# EAGLE board 3d_force_DACV2.4.1fix (EAGLE 9.5.2)
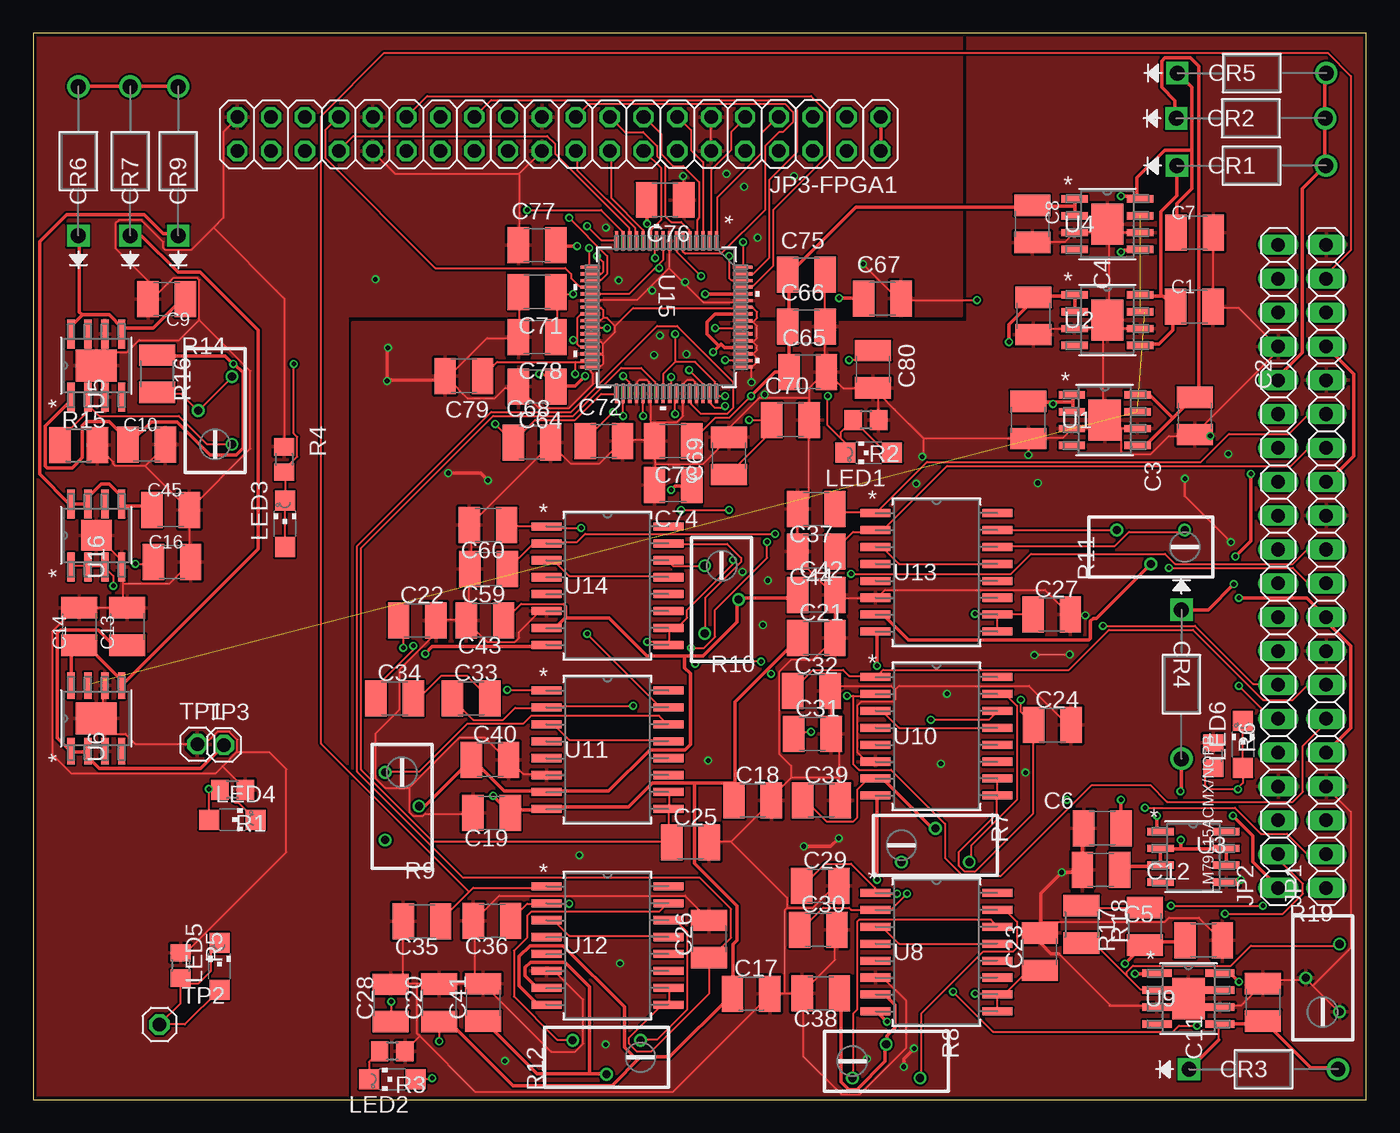
[diagram p5: board, top side]
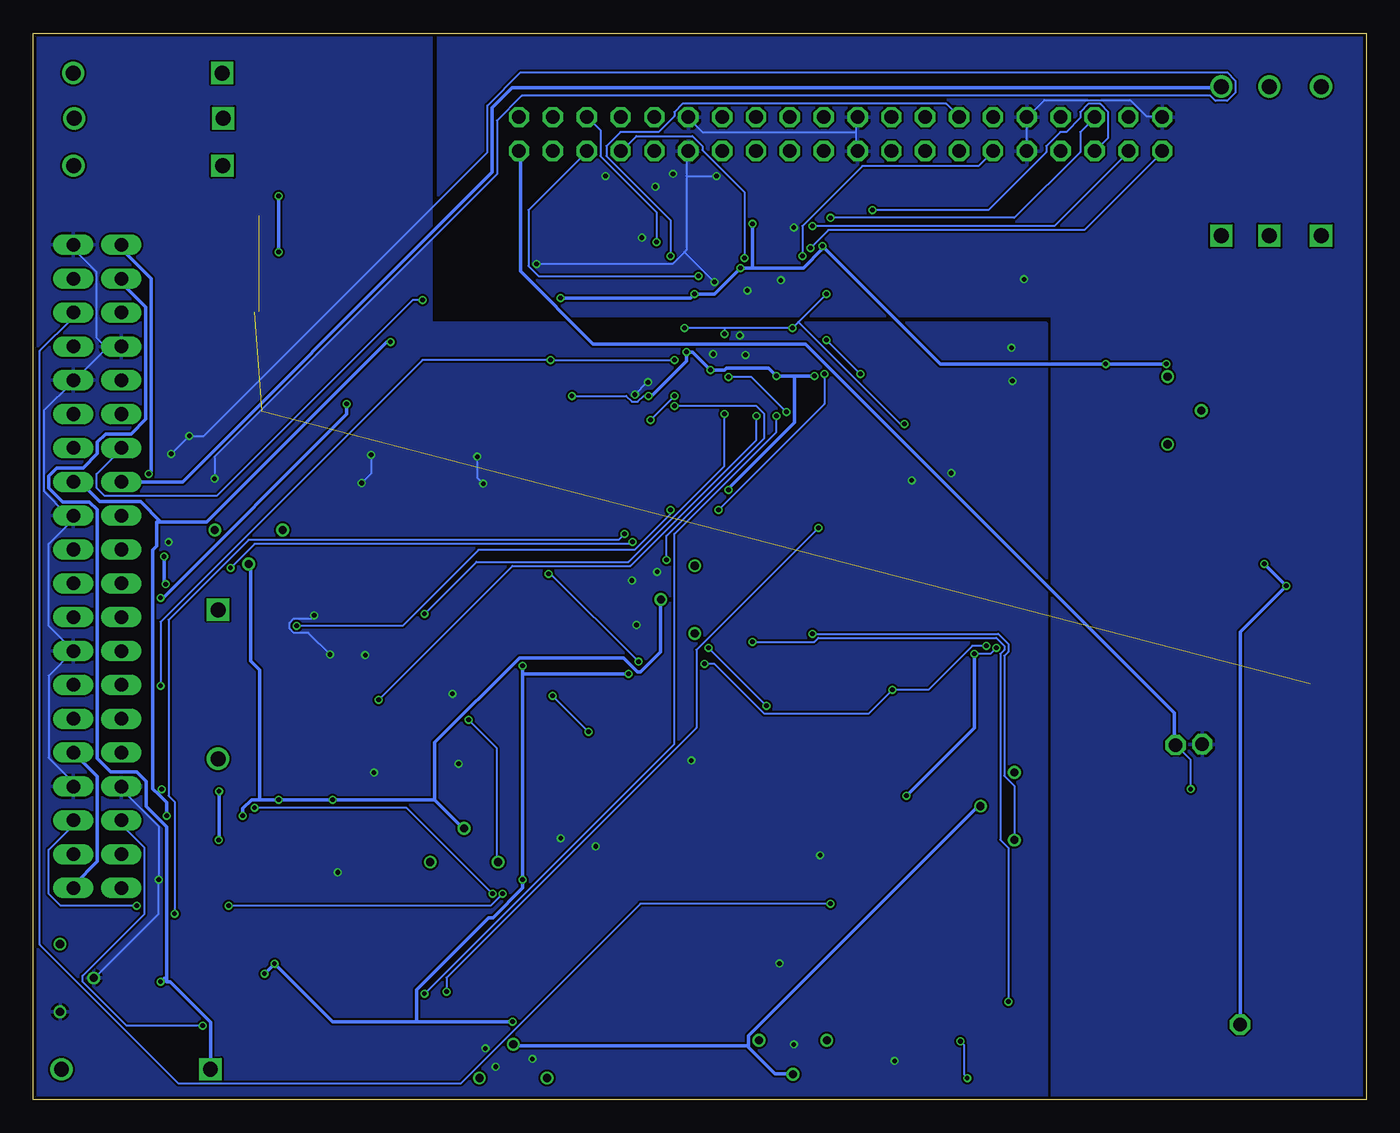
[diagram p6: board, bottom side, seen from below]

Size 100 x 80 mm. Coordinates in mm from the lower left corner, seen from the top.
Outline: 0,0 100,0 100,80 0,80 0,0
Copper layers (1*16): Top 0.018mm / dielectric 1.55mm / Bottom 0.018mm
Design rules "eC_2Layer_PClass6_BaseCopperO18_eCDefault": minimum track width 0.15mm, minimum drill 0.35mm, track to track 0.15mm, track to pad 0.15mm, pad to pad 0.15mm, via to via 0.15mm, smd to smd 0mil, copper to edge 0.25mm, drill to drill 0.35mm, minimum pad ring 0.175mm, minimum via ring 0.125mm, stop-mask expansion 0mil, vias tented up to drill 0.45mm, thermal gap 0.2mm

## Footprints (pad centres in the part's own frame; a part is rotated, then mirrored left to right if it is on the bottom)
C1210 = smd 1.6 x 2.7: 1 -1.4,0; 2 1.4,0
DO-41 = drill 1.118 pad 1.626 square: 1 -11.176,0 | drill 1.118 pad 1.626: 2 0,0
1X20 = drill 1.016 long: 1 -24.13,0; 2 -21.59,0; 3 -19.05,0; 4 -16.51,0; 5 -13.97,0; 6 -11.43,0; 7 -8.89,0; 8 -6.35,0; 9 -3.81,0; 10 -1.27,0; 11 1.27,0; 12 3.81,0; 13 6.35,0; 14 8.89,0; 15 11.43,0; 16 13.97,0; 17 16.51,0; 18 19.05,0; 19 21.59,0; 20 24.13,0
2X20 = drill 1.016 octagon: 1 -24.13,-1.27; 2 -24.13,1.27; 3 -21.59,-1.27; 4 -21.59,1.27; 5 -19.05,-1.27; 6 -19.05,1.27; 7 -16.51,-1.27; 8 -16.51,1.27; 9 -13.97,-1.27; 10 -13.97,1.27; 11 -11.43,-1.27; 12 -11.43,1.27; 13 -8.89,-1.27; 14 -8.89,1.27; 15 -6.35,-1.27; 16 -6.35,1.27; 17 -3.81,-1.27; 18 -3.81,1.27; 19 -1.27,-1.27; 20 -1.27,1.27; 21 1.27,-1.27; 22 1.27,1.27; 23 3.81,-1.27; 24 3.81,1.27; 25 6.35,-1.27; 26 6.35,1.27; 27 8.89,-1.27; 28 8.89,1.27; 29 11.43,-1.27; 30 11.43,1.27; 31 13.97,-1.27; 32 13.97,1.27; 33 16.51,-1.27; 34 16.51,1.27; 35 19.05,-1.27; 36 19.05,1.27; 37 21.59,-1.27; 38 21.59,1.27; 39 24.13,-1.27; 40 24.13,1.27
CHIPLED_1206 = smd 1.5 x 1.5: A 0,-1.75; C 0,1.75
R0805 = smd 1.3 x 1.5: 1 -0.95,0; 2 0.95,0
RTRIM3296Y = drill 0.61: 1 1.27,-2.54; 2 -1.27,0; 3 1.27,2.54
R1210 = smd 1.6 x 2.7: 1 -1.4,0; 2 1.4,0
1X01 = drill 1.016 octagon: 1 0,0
RD_8_2 = smd 1.981 x 0.559: 1 -2.464,1.905; 2 -2.464,0.635; 3 -2.464,-0.635; 4 -2.464,-1.905; 5 2.464,-1.905; 6 2.464,-0.635; 7 2.464,0.635; 8 2.464,1.905 | smd 2.413 x 3.099: EPAD 0,0
M08A = smd 1.981 x 0.559: 1 -2.464,1.905; 2 -2.464,0.635; 3 -2.464,-0.635; 4 -2.464,-1.905; 5 2.464,-1.905; 6 2.464,-0.635; 7 2.464,0.635; 8 2.464,1.905
RD_8_2' = smd 2.184 x 0.559: 1 -2.362,1.905; 2 -2.362,0.635; 3 -2.362,-0.635; 4 -2.362,-1.905; 5 2.362,-1.905; 6 2.362,-0.635; 7 2.362,0.635; 8 2.362,1.905 | smd 2.413 x 3.099: 9 0,0
SO-G16G6.9 = smd 2.261 x 0.61: 1 -9.149,8.89; 2 -9.149,7.62; 3 -9.149,6.35; 4 -9.149,5.08; 5 -9.149,3.81; 6 -9.149,2.54; 7 -9.149,1.27; 8 -9.149,0; 9 0,0; 10 0,1.27; 11 0,2.54; 12 0,3.81; 13 0,5.08; 14 0,6.35; 15 0,7.62; 16 0,8.89
21-0084C = smd 1.473 x 0.229: 1 -5.715,3.75; 2 -5.715,3.25; 3 -5.715,2.75; 4 -5.715,2.25; 5 -5.715,1.75; 6 -5.715,1.25; 7 -5.715,0.75; 8 -5.715,0.25; 9 -5.715,-0.25; 10 -5.715,-0.75; 11 -5.715,-1.25; 12 -5.715,-1.75; 13 -5.715,-2.25; 14 -5.715,-2.75; 15 -5.715,-3.25; 16 -5.715,-3.75; 33 5.715,-3.75; 34 5.715,-3.25; 35 5.715,-2.75; 36 5.715,-2.25; 37 5.715,-1.75; 38 5.715,-1.25; 39 5.715,-0.75; 40 5.715,-0.25; 41 5.715,0.25; 42 5.715,0.75; 43 5.715,1.25; 44 5.715,1.75; 45 5.715,2.25; 46 5.715,2.75; 47 5.715,3.25; 48 5.715,3.75 | smd 0.229 x 1.473: 17 -3.75,-5.715; 18 -3.25,-5.715; 19 -2.75,-5.715; 20 -2.25,-5.715; 21 -1.75,-5.715; 22 -1.25,-5.715; 23 -0.75,-5.715; 24 -0.25,-5.715; 25 0.25,-5.715; 26 0.75,-5.715; 27 1.25,-5.715; 28 1.75,-5.715; 29 2.25,-5.715; 30 2.75,-5.715; 31 3.25,-5.715; 32 3.75,-5.715; 49 3.75,5.715; 50 3.25,5.715; 51 2.75,5.715; 52 2.25,5.715; 53 1.75,5.715; 54 1.25,5.715; 55 0.75,5.715; 56 0.25,5.715; 57 -0.25,5.715; 58 -0.75,5.715; 59 -1.25,5.715; 60 -1.75,5.715; 61 -2.25,5.715; 62 -2.75,5.715; 63 -3.25,5.715; 64 -3.75,5.715
RD_8_1 = smd 2.184 x 0.559: 1 -2.362,1.905; 2 -2.362,0.635; 3 -2.362,-0.635; 4 -2.362,-1.905; 5 2.362,-1.905; 6 2.362,-0.635; 7 2.362,0.635; 8 2.362,1.905 | smd 2.286 x 2.286: 9 0,0

## Placement (x,y rotation side)
C1  1uF  [C1210]  87.11,59.5 0 top
C2  1uF  [C1210]  87.14,51.3 270 top
C3  1uF  [C1210]  74.64,51 270 top
C4  1uF  [C1210]  75.04,58.8 270 top
C5  0.1uF  [C1210]  80.2,20.36 180 top
C6  0.33uF  [C1210]  80.1,17.24 0 top
C7  1uF  [C1210]  87.13,65.04 0 top
C8  1uF  [C1210]  74.94,65.7 270 top
C9  1uF  [C1210]  10,60.06 180 top
C10  1uF  [C1210]  8.5,49.14 0 top
C11  1uF  [C1210]  92.26,7.3 90 top
C12  1uF  [C1210]  87.8,11.94 0 top
C13  1uF  [C1210]  7.06,35.5 90 top
C14  1uF  [C1210]  3.46,35.5 90 top
C16  2.2uF  [C1210]  10.4,40.34 0 top
C17  1uF  [C1210]  53.86,7.94 0 top
C18  1uF  [C1210]  53.97,22.44 0 top
C19  1uF  [C1210]  34.38,21.5 180 top
C20  1uF  [C1210]  30.46,7.26 90 top
C21  1uF  [C1210]  58.74,34.64 0 top
C22  1uF  [C1210]  28.8,35.94 0 top
C23  100pF  [C1210]  75.5,11.09 90 top
C24  100pF  [C1210]  76.45,28.09 0 top
C25  100pF  [C1210]  49.3,19.29 0 top
C26  100pF  [C1210]  50.71,12.05 90 top
C27  100pF  [C1210]  76.4,36.39 0 top
C28  100pF  [C1210]  26.81,7.25 90 top
C29  10pF  [C1210]  59.04,16.04 0 top
C30  10pF  [C1210]  58.89,12.74 0 top
C31  10pF  [C1210]  58.45,27.44 0 top
C32  10pF  [C1210]  58.38,30.64 0 top
C33  10pF  [C1210]  32.84,30.1 0 top
C34  10pF  [C1210]  27.1,30.1 0 top
C35  10pF  [C1210]  29.16,13.36 180 top
C36  10pF  [C1210]  34.41,13.41 180 top
C37  10pF  [C1210]  58.74,44.31 180 top
C38  1uF  [C1210]  59.08,7.96 180 top
C39  1uF  [C1210]  59.13,22.44 0 top
C40  1uF  [C1210]  34.26,25.5 0 top
C41  1uF  [C1210]  33.76,7.28 90 top
C42  1uF  [C1210]  58.74,37.84 0 top
C43  1uF  [C1210]  33.88,35.96 180 top
C44  10pF  [C1210]  58.74,41.11 180 top
C45  2.2uF  [C1210]  10.3,44.24 0 top
C59  10pF  [C1210]  34.16,39.81 180 top
C60  10pF  [C1210]  34.11,43.11 180 top
C64  0.1uF  [C1210]  37.8,53.5 180 top
C65  0.1uF  [C1210]  58.1,54.6 0 top
C66  0.1uF  [C1210]  58,58 0 top
C67  0.1uF  [C1210]  63.7,60.1 0 top
C68  33uF  [C1210]  37.4,49.3 0 top
C69  33uF  [C1210]  52.2,48.3 90 top
C70  33uF  [C1210]  56.8,51 0 top
C71  33uF  [C1210]  37.8,60.6 180 top
C72  0.1uF  [C1210]  42.8,49.4 0 top
C73  0.1uF  [C1210]  48,49.4 180 top
C74  0.1uF  [C1210]  48,46.1 180 top
C75  0.1uF  [C1210]  58,61.9 0 top
C76  0.1uF  [C1210]  47.4,67.5 180 top
C77  0.1uF  [C1210]  37.8,64.1 0 top
C78  33uF  [C1210]  37.8,57.2 180 top
C79  100pF  [C1210]  32.3,54.3 180 top
C80  100pF  [C1210]  63,54.8 270 top
CR1  1N4004G-T  [DO-41]  96.98,70.07 0 top
CR2  1N4004G-T  [DO-41]  96.93,73.62 0 top
CR3  1N4004G-T  [DO-41]  97.89,2.27 0 top
CR4  1N4004G-T  [DO-41]  86.14,25.57 270 top
CR5  1N4004G-T  [DO-41]  97.01,77.02 0 top
CR6  1N4004G-T  [DO-41]  3.38,76 90 top
CR7  1N4004G-T  [DO-41]  7.27,76 90 top
CR9  1N4004G-T  [DO-41]  10.87,76 90 top
JP1  JP1  [1X20]  97,40 90 top
JP2  JP2  [1X20]  93.4,40 90 top
JP3-FPGA1  FPGA-J3  [2X20]  39.43,72.44 180 top
LED1  [CHIPLED_1206]  62.67,48.53 90 top
LED2  [CHIPLED_1206]  26.93,1.52 90 top
LED3  [CHIPLED_1206]  18.88,43.19 0 top
LED4  [CHIPLED_1206]  14.93,21 270 top
LED5  [CHIPLED_1206]  13.97,9.99 0 top
LED6  [CHIPLED_1206]  90.76,26.65 0 top
R1  100  [R0805]  14.95,23.25 180 top
R2  100  [R0805]  62.47,50.99 180 top
R3  100  [R0805]  26.93,3.63 180 top
R4  100  [R0805]  18.82,48.03 270 top
R5  100  [R0805]  11.04,10.06 270 top
R6  100  [R0805]  88.53,25.81 270 top
R7  100k  [RTRIM3296Y]  67.68,19.08 270 top
R8  100k  [RTRIM3296Y]  63.99,2.88 270 top
R9  100k  [RTRIM3296Y]  27.66,22.01 180 top
R10  100k  [RTRIM3296Y]  51.65,37.51 180 top
R11  100k  [RTRIM3296Y]  83.84,41.46 90 top
R12  100k  [RTRIM3296Y]  43.01,3.17 90 top
R14  10k  [RTRIM3296Y]  13.63,51.7 0 top
R15  150K  [R1210]  3.4,49.09 0 top
R16  300k  [R1210]  9.29,54.46 270 top
R17  10k  [R1210]  78.64,13.14 270 top
R18  450k  [R1210]  83.41,12.99 90 top
R19  100k  [RTRIM3296Y]  96.73,9.12 0 top
TP1  FPGA_GND  [1X01]  12.3,26.66 0 top
TP2  FPGA_1V2  [1X01]  9.46,5.63 0 top
TP3  FPGA_3V3  [1X01]  14.3,26.6 0 top
U1  ADP7102ARDZ-5.0-R7  [RD_8_2]  80.38,50.98 0 top
U2  ADP7102ARDZ-5.0-R7  [RD_8_2]  80.58,58.48 0 top
U3  LM79L15ACMX/NOPB  [M08A]  87.03,18.21 0 top
U4  ADP7102ARDZ-5.0-R7  [RD_8_2]  80.58,65.68 0 top
U5  ADP7102ARDZ-R7  [RD_8_2']  4.72,55.07 90 top
U6  ADP7102ARDZ-3.3-R7  [RD_8_2]  4.72,28.59 90 top
U8  INA110KU  [SO-G16G6.9]  72.33,6.61 0 top
U9  ADP7102ARDZ-R7  [RD_8_2']  86.67,7.57 0 top
U10  INA110KU  [SO-G16G6.9]  72.33,22.81 0 top
U11  INA110KU  [SO-G16G6.9]  47.65,21.8 0 top
U12  INA110KU  [SO-G16G6.9]  47.65,7.11 0 top
U13  INA110KU  [SO-G16G6.9]  72.33,35.11 0 top
U14  INA110KU  [SO-G16G6.9]  47.65,34.11 0 top
U15  MAX11046ECB+  [21-0084C]  47.5,58.7 270 top
U16  ADP7118ARDZ  [RD_8_1]  4.72,42.33 90 top

## Tracks (layer width: path | path; a pad name or v marks a point on that pad's centre or on a via)
+15V
  Top 0.152: R3.2 25.18,2.83 LED2.C
+18V_IN  (via drill 0.35)
  Top 0.15: 92.1,5.7 92.25,5.85 C11.1 92.4,5.85 | 89.1,5.7 U9.5 88.95,5.55 88.95,4.5 | 97.8,2.4 CR3.2 | 89.1,9.45 U9.8 | 86.85,2.4 CR3.1
  Top 0.254: 92.1,5.7 89.1,5.7 | 97.8,2.4 95.85,2.4 92.4,5.85 | 89.1,9.45 89.85,9.45 v90.45,8.85 | 86.85,2.4 88.95,4.5
  Bottom 0.15: 86.7,2.4 CR3.1
  Bottom 0.254: 90,9.11 90.19,9.11 v90.45,8.85 | 86.7,2.4 86.7,5.81 89.73,8.84 90,8.84 90,9.11 | 90,9.11 90,20.45 91.53,21.98 91.53,23.88 92.25,24.6 94.2,24.6 95.2,25.6 95.2,44.26 95.79,44.85 97.8,44.85 98.85,45.9 98.85,46.8 98.25,47.4 96.26,47.4 95.2,48.46 95.2,49.32 94.57,49.95 92.65,49.95 91.56,51.04 91.56,59.46 93.3,61.2 93.3,61.5 JP2.19
-18V_IN  (via drill 0.35)
  Top 0.254: v91.35,46.95 91.35,41.91 v90.19,40.75 | v90.07,38.66 88.16,36.75 CR4.1
  Bottom 0.152: 90.19,38.86 90,38.67 90.01,38.66 v90.07,38.66
  Bottom 0.254: v91.35,46.95 91.14,47.16 91.14,61.59 93.3,63.75 93.3,64.05 JP2.20 | v90.19,40.75 90.19,38.86
-18V_IN1  (via drill 0.35)
  Top 0.152: U3.7 89.44,18.79 89.5,18.73 | 86.09,18.84 86.04,18.79 | U3.6 89.5,17.59 | U3.3 84.48,17.48
  Top 0.2: U3.2 84.62,18.79 85.13,18.79
  Top 0.254: 89.44,18.79 86.04,18.79 85.13,18.79 | v86.09,19.47 86.09,18.84 | 89.5,18.73 89.5,17.59 | C6.2 81.75,17.48 84.48,17.48 | U3.2 84.56,18.84 84.56,17.59 U3.3 | CR4.2 86.14,23.2 v86.07,23.13
  Bottom 0.152: 86.07,19.49 v86.09,19.47
  Bottom 0.254: v86.07,23.13 86.07,19.49
A5V_IN1
  Top 0.15: 96.9,73.65 CR2.2 96.9,73.5 | 96.9,76.95 CR5.2 | 96.9,70.05 CR1.2 96.9,70.2
  Top 0.254: 96.9,76.95 96.9,73.65 | 96.9,70.05 95.2,68.35 95.2,56.05 93.45,54.3 93.45,54 JP2.16 | 96.9,70.2 96.9,73.5
A5V_IN1_1
  Top 0.15: 83.1,56.7 U2.5 | 85.5,59.42 C1.1 85.63,59.5 | 84.75,60.3 84.6,60.3 | 83.1,60.3 U2.8 | 85.8,70.05 CR1.1
  Top 0.254: 83.1,56.7 84.45,56.7 85.5,57.75 85.5,59.42 | 83.1,60.3 84.6,60.3 84.6,66.63 85.8,67.83 85.8,70.05 | 85.63,59.5 84.75,60.3
A5V_IN1_2
  Top 0.15: 83.55,49.2 82.95,49.2 U1.5 | 87,52.65 C2.1 87.15,52.8 87.43,53.08 | 82.95,52.8 U1.8
  Top 0.254: 87,52.65 85.5,51.15 | 85.5,51.15 83.55,49.2 | 82.95,52.8 83.85,52.8 85.5,51.15 | 87.43,53.08 87.43,77.53 86.81,78.15 84.88,78.15 84.65,77.92 84.65,75.95 85.65,74.95 85.65,73.65 CR2.1
A5V_IN1_3  (via drill 0.35)
  Top 0.15: v81.6,63.6 81.75,63.75 | 82.95,63.75 U4.5 | 85.8,65.08 C7.1 | 82.95,67.65 82.8,67.8 U4.8 82.95,67.65
  Top 0.254: 81.75,63.75 82.95,63.75 | v81.6,67.8 82.8,67.8 82.8,69.15 84.9,71.25 86.93,71.25 | 85.8,65.08 85.8,67.2 86.93,68.33 86.93,71.25 | 86.93,71.25 86.93,75.97 85.95,76.95 CR5.1
  Bottom 0.254: v81.6,67.8 v81.6,63.6
A15V+  (via drill 0.35)
  Top 0.15: 84.3,9.45 U9.1 | 83.4,11.7 R18.1 83.55,11.7 83.7,11.85 | 63.3,6.6 U8.8 | 63.3,22.8 U10.8 | 63.3,35.1 U13.8 | 86.4,11.85 C12.1 | 52.35,7.8 C17.1 52.5,7.95 | 31.2,5.85 30.6,5.85 C20.1 | v27.75,33.9 27.75,35.55 27.45,35.85 C22.1 | 38.4,21.75 U11.8 38.57,21.94 | 35.85,21.6 C19.1 35.7,21.6 | 52.65,23.74 52.65,23.7 C18.1 52.65,22.5 | 57.3,34.5 C21.1
  Top 0.152: C20.1 v30.46,4.38 v30.45,4.37 | v29.93,1.61 29.84,1.52 LED2.A
  Top 0.254: v82.65,9.45 84.3,9.45 | 83.4,11.7 v81.9,10.2 | v64.05,5.85 63.3,6.6 | v63.3,16.5 63.3,22.8 | v63.3,32.55 63.3,35.1 | 83.7,11.85 86.4,11.85 | 45.56,3.19 47.74,3.19 52.35,7.8 | 45.56,3.19 45.07,3.19 44.34,3.92 44.34,6.96 39.75,11.55 37.28,11.55 36.46,10.73 36.46,8.54 37.8,7.2 38.4,7.2 U12.8 | 31.2,5.85 36,1.05 43.42,1.05 45.56,3.19 | v29.4,33.45 29.93,33.98 38.28,33.98 U14.8 | 38.4,21.75 36,21.75 35.85,21.6 | 52.65,23.7 52.65,22.5 | 57.3,34.5 55.05,32.25 | 55.05,32.25 52.65,29.85 52.65,23.74 49.62,23.74 | 38.57,21.94 44.67,21.94 46.47,23.74 49.62,23.74 | 35.7,21.6 v34.5,22.8 | 52.5,7.95 52.5,11.66 52.79,11.95 52.79,14.55 49.62,17.72 49.62,23.74 | 55.05,32.25 v55.35,31.95
  Bottom 0.15: v29.4,33.45 28.2,33.45 v27.75,33.9
  Bottom 0.152: v30.45,4.37 30.17,4.09 30.17,1.88 29.93,1.64 v29.93,1.61
  Bottom 0.254: v82.65,9.45 v81.9,10.2 77.55,5.85 71.25,5.85 | 71.25,5.85 v64.05,5.85 | 63.3,31.95 v63.3,16.5 63.3,15.87 65.52,13.65 65.84,13.65 71.25,8.24 71.25,5.85 | 63.3,31.95 v63.3,32.55 | v29.4,33.45 29.4,27.9 v34.5,22.8 | v55.35,31.95 63.3,31.95
A15V-  (via drill 0.35)
  Top 0.15: 63.3,36.3 U13.7 | 63.3,24 U10.7 63.15,24 62.55,24 61.8,23.25 61.8,21.15 61.5,20.85 59.55,20.85 58.05,22.35 57.75,22.35 C39.1 | 63.97,7.8 63.3,7.8 U8.7 | 64.05,4.2 R8.2 63.9,4.05 | 60.6,7.95 C38.1 | 42.9,1.95 R12.2 | 33.9,5.85 C41.1 | 37.8,8.4 38.4,8.4 U12.7 | 28.95,22.05 R9.2 | C40.1 33,25.5 | 39.94,37.01 39.75,37.2 36.6,37.2 35.4,36 C43.1 | 38.55,35.4 U14.7 | 57.15,37.65 57.3,37.8 C42.1 | 52.95,37.65 R10.2 52.8,37.5 | 38.62,23.14 U11.7
  Top 0.2: 84.3,20.38 U3.1
  Top 0.254: 63.3,36.3 63.87,36.3 65.67,34.5 79.21,34.5 79.31,34.6 79.31,35.89 79.52,36.1 79.75,36.1 R11.2 | 63.3,24 63.83,24 67.43,20.4 67.65,20.4 R7.2 | v84.3,21.3 84.3,20.56 84.3,20.38 | 64.05,4.2 64.05,4.8 64.65,5.4 64.65,7.12 63.97,7.8 | 60.6,7.95 60.6,1.35 61.2,0.75 61.78,0.75 63.9,2.87 63.9,4.05 | 41.74,1.95 37.8,1.95 33.9,5.85 | 41.74,1.95 42.9,1.95 | 37.8,8.4 36.91,9.29 36.91,9.91 37.29,10.29 39.9,10.29 41.74,8.45 41.74,1.95 | 28.95,22.05 29.4,22.05 C40.1 | 33,25.5 35.33,23.17 38.17,23.17 U11.7 | 38.55,35.4 39.15,35.4 39.9,36.15 39.94,36.15 | 39.94,37.01 39.94,36.15 | 57.15,37.65 52.95,37.65 | 39.94,36.15 43.21,36.15 46.06,33.3 48.89,33.3 | 48.89,33.3 50.25,33.3 52.8,35.85 52.8,37.5 | 38.62,23.14 43.17,23.14 46.28,26.25 48.9,26.25 49.29,26.64 49.29,31.97 48.86,32.4 48.86,33.27 48.89,33.3 | C5.1 v81.6,22.5
  Bottom 0.15: 43.05,1.95 R12.2 | 28.99,22.13 R9.2 | 52.95,37.5 R10.2
  Bottom 0.254: v84.3,21.3 84.3,21.83 83.63,22.5 83.03,22.5 | 69.9,22.5 v77.55,22.5 v81.6,22.5 83.03,22.5 | 69.9,22.5 67.8,20.4 R7.2 | 83.03,22.5 83.03,32.25 83.7,32.92 83.7,40.05 R11.2 | 46.46,4.05 46.35,4.05 46.35,4.77 28.99,22.13 | 46.46,4.05 63.9,4.05 R8.2 | 46.46,4.05 44.36,1.95 43.05,1.95 | 69.9,22.5 69.9,26.78 63.53,33.15 55.72,33.15 54.67,32.1 54.45,32.1 52.95,33.6 52.95,37.5
ADC_AV5.3  (via drill 0.35)
  Top 0.15: 40.8,57 40.8,58.65 41.1,58.95 U15.24 | 40.8,57 40.8,56.7 40.95,56.55 41.7,56.55 U15.29 | v44.25,54.3 44.7,53.85 44.7,53.1 U15.35 | 39.3,53.55 C64.1 38.25,54.45 v37.95,54.45 | U15.46 50.25,53.7 v49.2,54.75 | v40.5,57 40.8,57 | 49.35,46.05 C74.1 | C73.1 51.15,51.15 52.2,51.15 v53.85,52.8 | 56.7,57.9 C66.1 56.7,58.05 | 56.7,61.8 C75.1 56.7,61.95 | 78.15,66.45 U4.2 | 78.15,67.5 U4.1 | 75,67.05 C8.1
  Top 0.152: LED1.C 60.92,49.27 60.56,49.63 | 60.56,49.63 60.56,50.03 61.45,50.92 R2.2 63.98,48.53 LED1.A | 60.56,49.63 59.59,50.6 59.59,52.82 v59.6,52.81 v59.6,52.8 | 74.9,66.95 75,67.05
  Top 0.254: U15.52 53.2,56.43 51.87,56.43 51.6,56.7 51.45,56.55 | 51.45,56.55 50.55,57.45 50.55,58.35 51.15,58.95 U15.57 | v41.4,54.3 40.65,53.55 39.3,53.55 | 49.35,46.05 48.15,46.05 v47.85,45.75 | v51,56.1 51.45,56.55 | v53.85,52.8 55.65,54.6 C65.1 56.7,57.9 | 56.7,58.05 56.7,61.8 | 56.7,61.95 61.7,66.95 74.9,66.95 | 78.15,67.5 78.15,67.05 | 78.15,67.05 78.15,66.45 | 75,67.05 78.15,67.05
  Bottom 0.15: v37.95,54.45 v40.5,57
  Bottom 0.152: v59.6,52.8 55.52,52.8 55.09,52.36 54.65,52.36 54.22,52.8 v53.85,52.8
  Bottom 0.254: v41.4,54.3 42.9,54.3 | 42.9,54.3 v44.25,54.3 44.85,54.9 48,54.9 48.15,54.75 v49.2,54.75 50.55,56.1 v51,56.1 51,55.42 53.62,52.8 v53.85,52.8 | v47.85,45.75 47.85,45.86 42.9,50.81 42.9,54.3
ADC_DV3.7  (via drill 0.35)
  Top 0.15: 2.7,52.35 2.7,52.65 U5.1 | 9.3,55.8 R16.1 | 7.2,49.2 C10.1 | U15.21 44.7,60.45 46.8,62.55 | 46.8,62.55 47.25,63 U15.9 | 46.8,62.55 v46.95,62.4 | 39.3,64.05 C77.2 | 46.05,67.5 C76.2 | 62.25,60.15 C67.1
  Top 0.152: LED3.A LED3.C 18.88,47.02 R4.2 18.82,47.26 19.8,48.24 19.8,49.72 19.54,49.98 v19.54,55.2
  Top 0.254: 2.7,52.35 0.9,50.55 0.9,47.53 1.03,47.4 2.9,47.4 3.68,48.18 3.68,50.58 3.97,50.87 5.7,50.87 7.29,49.28 | 9.3,55.8 14.4,55.8 v15,55.2 15.08,55.2 15.75,54.53 15.75,48.9 15.22,48.37 13.28,48.37 10.8,50.85 8.85,50.85 7.29,49.28 | 7.2,49.2 7.29,49.28 | v50.4,60.45 U15.60 | v40.8,64.05 39.3,64.05 | v46.05,65.7 46.05,67.5 | v60.45,60.15 62.25,60.15
  Bottom 0.254: 46.05,62.4 v46.95,62.4 48.9,60.45 v50.4,60.45 50.7,60.15 v60.45,60.15 | 46.05,62.4 42.23,62.4 40.8,63.83 v40.8,64.05 31.95,55.2 v19.54,55.2 v15,55.2 | 46.05,62.4 v46.05,65.7
AGND  (via drill 0.35)
  Top 0.15: C12.2 89.1,12 87.45,13.65 85.2,13.65 84.9,13.35 75.6,13.35 75.6,12.6 C23.2 75.6,12.45 | 96,8.55 95.55,9 R19.2 95.4,9 92.7,9 92.4,8.7 C11.2 90.6,7.05 89.1,7.05 U9.6 88.95,7.05 87.15,7.05 86.7,7.5 U9.9 86.55,7.5 86.1,7.05 84.45,7.05 U9.3 84.3,7.05 | 96,8.55 97.95,6.6 R19.1 | C7.2 88.51,65.02 C1.2 88.76,59.4 90.45,59.4 93.3,56.55 JP2.17 93.3,56.4 93.3,56.1 87.15,49.95 C2.2 87,49.8 85.2,49.8 83.85,48.45 81.75,48.45 81.6,48.6 81.6,50.4 | U1.EPAD 79.8,50.4 78,50.4 U1.3 77.85,50.25 77.25,49.65 74.7,49.65 C3.2 74.55,49.65 66.75,49.65 64.61,51.78 | 81.6,50.4 80.85,50.4 80.4,50.85 U1.EPAD | 81.6,50.4 82.8,50.4 U1.6 | 80.25,58.05 80.55,58.35 U2.EPAD | 80.25,58.05 80.1,57.9 78.15,57.9 U2.3 78.05,57.79 75.9,57.79 C4.2 | U2.6 82.95,57.9 81.15,57.9 80.7,58.35 U2.EPAD | U4.EPAD 80.55,65.55 80.1,65.1 78.15,65.1 U4.3 78,64.95 77.4,64.35 75,64.35 C8.2 | 81.15,65.1 82.95,65.1 U4.6 | 81.15,65.1 80.7,65.55 U4.EPAD | 81.15,65.1 80.7,64.65 80.7,58.5 U2.EPAD | 81.15,65.1 U4.EPAD | 80.25,58.05 80.25,51 U1.EPAD | 80.25,58.05 U2.EPAD | 96,8.55 98.85,11.4 98.85,21.6 97.05,23.4 JP1.4 | 28.8,8.7 30.45,8.7 C20.2 30.6,8.7 32.55,8.7 33.15,9.3 | 28.8,8.7 27.75,8.7 | 27.75,8.7 26.85,8.7 C28.2 27.75,8.7 | 27.75,8.7 C35.2 | U12.6 38.55,9.6 39.15,9.6 41.25,7.5 41.25,4.2 40.65,3.6 38.85,3.6 33.9,8.55 C41.2 | 33.15,9.3 33.15,13.35 C36.2 33.15,13.5 34.95,15.3 48.9,15.3 50.7,13.5 C26.2 | 33.15,9.3 33.75,8.7 C41.2 | 33.15,9.3 C41.2 | U8.6 63.75,9.15 65.5,7.4 65.5,3.87 62.01,0.38 60.62,0.38 57.75,3.25 57.75,7.95 C38.2 | 56.4,7.95 57.6,7.95 C38.2 | 56.4,7.95 55.35,7.95 C17.2 55.2,7.8 47.96,0.56 33.19,0.56 29,4.75 28.8,4.95 28.8,8.7
  Top 0.15: C30.2 60.15,12.6 60.15,10.5 57.75,8.1 C38.2 | 56.55,14.4 58.5,14.4 60,15.9 60.3,15.9 C29.2 | 56.55,14.4 56.4,14.25 56.4,7.95 | 52.35,19.35 50.7,19.35 C25.2 | 52.35,19.35 55.35,22.35 C18.2 55.5,22.5 55.5,22.8 56.85,24.15 | U10.6 62.55,25.35 61.8,26.1 61.8,29.55 62.1,29.85 64.5,29.85 64.65,30 64.65,30.75 | 64.65,30.75 64.35,31.05 60.15,31.05 59.85,30.75 C32.2 59.85,30.6 C31.2 59.85,27.3 60.45,26.7 60.45,24.15 | 60.45,24.15 60.45,22.5 C39.2 | 64.65,30.75 64.95,31.05 74.7,31.05 77.55,28.2 77.85,28.2 C24.2 | 60.45,24.15 56.85,24.15 | 56.55,14.4 56.55,15.15 52.35,19.35 | U11.6 38.4,24.45 36.75,24.45 35.7,25.5 C40.2 35.55,25.5 33.9,27.15 31.95,27.15 28.2,23.4 | 28.2,23.4 28.2,21.6 28.5,21.3 29.25,21.3 29.4,21.45 32.85,21.45 C19.2 | U14.6 38.4,36.6 37.95,36.6 36.45,35.1 36.45,34.65 36.15,34.35 34.05,34.35 32.55,35.85 C43.2 | C43.2 32.4,36 30.3,36 C22.2 30.15,35.85 30.15,34.95 27.45,32.25 27.45,29.25 25.65,27.45 25.65,24.15 26.4,23.4 28.2,23.4 | C43.2 32.55,36 32.7,36.15 32.7,39.75 C59.2 32.85,39.9 32.85,43.05 C60.2 32.85,43.2 38.85,49.2 | 53.88,55.05 54,55.05 54.3,55.35 54.3,55.65 54,55.95 | 53.88,55.05 53.25,55.05 U15.49 | U15.51 54,55.95 | 54,56.85 53.25,56.85 U15.53 | 54,56.85 54.3,56.55 54.3,56.25 54,55.95 | 54,58.35 53.25,58.35 U15.56 | 54,58.35 54.3,58.05 54.3,57.15 54,56.85 | 54,58.35 54.3,58.65 54.3,59.1 54,59.4 53.25,59.4 U15.58 53.1,59.4 45,59.4 43.65,58.05 | 42.75,58.65 42.6,58.5 41.85,58.5 U15.25 | 42.75,58.65 42.75,59.25 42.6,59.4 41.85,59.4 U15.23 | 42.75,55.8 42.75,55.2 42.6,55.05 41.85,55.05 U15.32 41.85,54.9 41.85,54.6 42,54.45 42,53.7 40.2,51.9 37.95,51.9 36.45,53.4 C64.2 36.3,53.4 35.4,53.4 34.65,52.65 32.55,52.65 31.22,53.98 31.05,54.15
  Top 0.15: 42.75,55.8 42.6,55.95 U15.30 | 42.75,56.7 42.6,56.85 41.85,56.85 U15.28 | 42.75,55.8 42.75,56.7 | 42.75,58.65 43.05,58.65 43.65,58.05 | 43.65,58.05 43.65,57.6 42.75,56.7 | C71.2 36.45,60.6 36.45,57.3 C78.2 36.3,57.15 34.05,57.15 31.05,54.15 | 31.05,54.15 C79.2 | 38.85,49.2 40.35,47.7 42.45,47.7 44.1,49.35 C72.2 44.25,49.5 46.5,49.5 | U15.45 49.65,53.1 49.65,53.85 49.5,54 49.05,54 48.75,53.7 U15.43 48.75,51.3 48.3,50.85 46.35,50.85 | U15.36 45.3,53.1 45.3,53.85 45.45,54 46.05,54 46.2,53.85 46.2,53.1 U15.38 46.35,52.95 46.35,50.85 | 46.35,50.85 46.35,49.65 46.5,49.5 | 46.65,47.7 46.65,49.35 C73.2 46.5,49.5 | 46.65,47.7 46.65,46.2 C74.2 | 46.65,47.7 50.25,47.7 52.2,49.65 C69.2 52.2,50.4 54.45,52.65 54.87,52.65 | 58.2,52.65 58.2,53.4 59.4,54.6 | 58.2,52.65 C70.2 58.2,45.15 57.45,44.4 C37.2 57.3,44.25 57.3,41.25 C44.2 57.45,41.1 57.45,40.5 60,37.95 C42.2 60.15,37.8 | C80.2 60.75,53.4 59.55,54.6 C65.2 59.4,54.6 | 59.4,54.6 C66.2 C75.2 | 60.15,37.8 60.3,37.65 U13.6 63.3,37.65 63.9,38.25 75.9,38.25 77.7,36.45 C27.2 | 60.15,37.8 C21.2 60,34.5 58.5,33 56.85,33 55.95,32.1 55.95,25.95 56.85,25.05 56.85,24.15 | 58.2,52.65 54.87,52.65 | v53.88,53.82 53.88,55.05 | 54.87,52.65 v54.87,52.89 | 38.85,49.2 C68.2
  Top 0.152: 78.7,20.26 C5.2 | C27.2 77.8,36.31 78.91,36.31 v78.93,36.33 | v75.1,33.34 75.16,33.4 v77.75,33.4 | C80.2 63.47,52.93 | 63.47,52.93 64.61,51.78 66.77,49.63 66.77,48.21 66.72,48.21 v66.69,48.24 | C3.2 v74.64,48.38 v74.65,48.38 | 75.6,11.71 75.6,12.45 | C6.1 78.5,17.04 | 76.95,10.95 80.78,7.12 80.78,7.05 | C2.2 88.2,49.9 v88.3,49.8 | R3.1 29,4.75 | R2.1 63.42,52.88 63.47,52.93 | v26.54,53.92 26.6,53.98
  Top 0.2: 80.78,7.05 84.3,7.05 | v89.86,41.82 86.41,45.27 v86.41,46.58 | U3.5 89.69,16.5 v90.6,16.5
  Top 0.254: v34.1,46.46 33.57,46.99 31.13,46.99 v31.13,47.01 | v26.54,53.92 26.54,56.35 26.59,56.4 26.59,56.41 v26.61,56.41 | v65.31,2.46 65.31,3.05 v66.09,3.83 v66.08,3.83 | v57.81,19 59.82,19 v60.43,19.61 | C6.1 78.7,20.26 | 76.95,10.95 76.36,10.95 75.6,11.71 | 78.5,17.04 v77.16,17.04 75.6,15.48 75.6,13.35 | 26.6,53.98 31.22,53.98
  Bottom 0.15: v90.6,16.5 90.6,20.51 93.4,23.31 JP2.4 | 90.6,16.06 90.6,13.95 95.4,9.15 R19.2 | JP1.4 97.05,23.55 97.05,23.85 98.85,25.65 98.85,31.8 JP1.8 97.05,33.75 98.85,35.55 98.85,41.7 97.05,43.5 97.05,43.8 JP1.12 97.05,43.95 97.52,43.95 99.21,45.64 99.21,51.69 97.05,53.85 JP1.16 96.9,54 94.5,56.4 | 94.5,56.4 93.45,56.4 JP2.17 94.5,56.4 | 94.5,56.4 95.25,57.15 95.25,62.1 96.9,63.75 96.9,64.05 JP1.20 | v54.87,52.89 53.94,53.82 v53.88,53.82
  Bottom 0.152: 90.6,16.06 v90.6,16.5 | v77.75,33.4 79.37,35.02 80.47,35.02 80.78,35.33 80.78,35.77 80.47,36.08 79.15,36.08 78.93,36.3 v78.93,36.33 | v89.65,48.45 v88.3,49.8 87.22,49.8 65.93,71.09 65.93,74.57 63.44,77.06 10.43,77.06 9.81,76.44 9.81,75.56 10.43,74.94 11.31,74.94 11.68,75.3 63.37,75.3 65.22,73.45 65.22,69.43 86.41,48.24 v86.41,46.58 | v66.69,48.24 66.69,46.66 v66.24,46.21 | v74.65,48.38 74.65,46.98 v75.37,46.26
  other vias: 68.09,25.19 68.56,30.45 74.44,24.53 50.63,25.43 40.97,18.33 44.02,10.21 55.1,38.95 54.74,35.61 53.2,39.59 62.56,3.05 42.94,4.13 35.38,2.89 47,57.33 46.57,55.87 48.99,55.93
  pour Bottom: 24.01,0.01 24.01,58.22 24.03,58.24 70.17,58.24 70.17,79.99 99.98,79.99 99.98,-0.02 24.02,-0.02
  pour Top: 23.96,0.09 23.96,58.29 70.11,58.29 70.11,79.88 99.91,79.88 99.91,0.09
AV5.1  (via drill 0.35)
  Top 0.15: 78,51.75 U1.2 | 78,52.8 U1.1 | 74.7,52.35 C3.1 | 97.05,36.15 JP1.9 96.9,36.3 | 97.05,26.1 JP1.5 | v76.5,52.2 76.5,52.35
  Top 0.254: 78,52.8 78,52.35 | 78,52.35 78,51.75 | 74.7,52.35 76.5,52.35 78,52.35 | 97.05,36.15 97.05,35.85 98.85,34.05 98.85,27.9 97.05,26.1 | v90.45,37.65 95.55,37.65 96.9,36.3
  Bottom 0.15: 96.9,25.95 JP1.5
  Bottom 0.254: 96.9,25.95 95.2,24.25 95.2,17.86 96.9,16.16 96.9,15.9 JP1.1 | v76.5,52.2 76.5,51.42 90.27,37.65 v90.45,37.65
AV5.2  (via drill 0.35)
  Top 0.15: 78.15,59.25 U2.2 | 78.15,60.3 U2.1 78,60.3 | 75.15,60.3 C4.1 75,60.15 75,59.94 | 93.3,15.9 JP2.1 | 97.27,55.92 JP1.17 | 97.13,46.35 JP1.13
  Top 0.152: R6.2 87.93,24.26 87.93,23.57 88.22,23.28 90.29,23.28 90.33,23.32 | 90.33,23.32 90.76,23.75 LED6.A LED6.C | 90.33,23.32 v90.38,23.28
  Top 0.254: 78.15,60.3 78.15,59.25 | 75.15,60.3 78,60.3 | 93.3,15.9 93.3,16.05 91.5,17.85 91.5,19.8 v90,21.3 | 97.27,55.92 97.27,56.24 99.07,54.44 99.07,48.29 97.13,46.35 | 75,59.94 73.2,58.14 v73.2,56.85
  Bottom 0.152: v90.38,23.28 90.61,23.05 90.61,22.89
  Bottom 0.254: v90,21.3 90,22.28 90.61,22.89 91.04,23.32 91.04,41.24 90.75,41.53 90.75,43.35 90.43,43.35 | 90.43,43.35 91.96,44.88 95.03,44.88 96.5,46.35 JP1.13 | v73.2,56.85 73.5,56.85 87,43.35 90.43,43.35
CONVST  (via drill 0.35)
  Top 0.15: v40.2,66.15 43.05,63.3 43.05,61.95 42.6,61.5 41.85,61.5 U15.19
  Bottom 0.15: v40.2,66.15 26.4,66.15 21.45,71.1 21.45,72.6 20.4,73.65 JP3-FPGA1.35
CS  (via drill 0.35)
  Top 0.15: v52.2,63.3 52.2,61.65 52.35,61.5 53.1,61.5 U15.62
  Bottom 0.15: v52.2,63.3 52.2,66 57,70.8 57,71.55 55.95,72.6 53.1,72.6 51.9,73.8 51.9,74.1 51.3,74.7 31.5,74.7 30.6,73.8 JP3-FPGA1.27
D5V_IN
  Top 0.15: 3.45,76.05 CR6.2 | 7.2,76.05 CR7.2 7.35,76.05 | 10.8,76.05 CR9.2
  Top 0.254: 7.2,76.05 3.45,76.05 | 10.8,76.05 7.35,76.05
  Bottom 0.15: CR9.2 10.95,75.9
  Bottom 0.254: JP2.13 88.8,46.35 69.38,65.78 65.58,69.58 65.58,74.42 64.1,75.9 10.95,75.9
D5V_IN_1
  Top 0.15: 2.85,58.05 2.85,57.45 U5.8 | 11.1,60 11.4,60 C9.1 | 3.45,64.8 CR6.1 | 6.6,57.45 6.6,57.9 U5.5 6.6,57.45
  Top 0.254: 2.85,58.05 3.67,58.88 3.66,58.89 | 3.66,58.89 5.69,58.89 6.68,57.9 | 11.1,60 9,57.9 6.68,57.9 | 6.6,57.9 6.68,57.9 | 3.45,64.8 3.45,59.1 3.66,58.89
D5V_IN_2
  Top 0.15: 2.85,33.45 3.45,34.05 C14.1 3.6,34.05 4.05,34.05 | 2.85,31.2 U6.8 | 6.6,31.5 6.6,31.2 U6.5 6.75,31.2
  Top 0.254: 2.85,33.45 2.85,31.2 | 4.05,34.05 6.6,31.5 | 6.75,31.2 16.86,41.31 16.86,57.73 12.51,62.08 10.85,62.08 8.13,64.8 7.35,64.8 CR7.1
D5V_IN_3
  Top 0.15: 2.85,44.7 U16.8 2.7,44.7 | 4.05,44.7 U16.7 4.2,44.7 4.2,45.3 | 8.55,44.55 8.85,44.25 C45.1 | 6.75,44.55 U16.5 6.6,44.7 6.6,45.3
  Top 0.254: 4.05,44.7 2.85,44.7 | 8.55,44.55 6.75,44.55 | 4.2,45.3 5.09,46.19 5.71,46.19 6.6,45.3 | 2.7,44.7 0.47,46.93 0.47,64.37 2.51,66.41 8.3,66.41 9.76,64.95 10.81,64.95 10.87,64.84 CR9.1
DB0  (via drill 0.35)
  Top 0.15: v41.7,63.9 41.7,62.55 U15.17
  Bottom 0.15: v41.7,63.9 40.35,65.25 21.15,65.25 15.3,71.1 JP3-FPGA1.40
DB1  (via drill 0.35)
  Top 0.15: v41.55,65.55 42.6,64.5 43.65,64.5 U15.16
  Bottom 0.15: v41.55,65.55 23.4,65.55 17.85,71.1 JP3-FPGA1.38
DB2  (via drill 0.35)
  Top 0.15: U15.15 44.25,65.1 42.6,66.75 v37.05,66.75
  Bottom 0.15: v37.05,66.75 28.35,66.75 24,71.1 24,71.55 22.95,72.6 22.5,72.6 21.45,73.65 21.45,74.1 20.85,74.7 19.95,74.7 19.35,74.1 19.35,72.15 20.25,71.25 JP3-FPGA1.36
DB3
  Top 0.15: U15.14 44.7,64.5 44.7,65.4 39.15,70.95 39.15,71.7 38.55,72.3 24,72.3 22.95,71.25 JP3-FPGA1.34
DB4
  Top 0.15: U15.13 45.15,64.5 45.15,65.4 40.8,69.75 40.8,71.1 JP3-FPGA1.20
DB5
  Top 0.15: U15.12 45.75,65.25 43.35,67.65 43.35,71.1 JP3-FPGA1.18
DB6
  Top 0.15: U15.11 46.35,64.5 46.35,65.25 47.1,66 47.1,69.9 45.9,71.1 JP3-FPGA1.16
DB7  (via drill 0.35)
  Top 0.15: v46.65,63.15 46.65,64.35 U15.10
  Bottom 0.15: v46.65,63.15 46.65,68.1 49.8,71.25 49.8,71.55 50.55,72.3 54.75,72.3 55.8,71.25 JP3-FPGA1.8
DB8  (via drill 0.35)
  Top 0.15: v50.1,61.8 48.3,63.6 48.3,64.35 U15.7
  Bottom 0.15: v50.1,61.8 62.1,61.8 62.85,62.55 62.85,66.75 58.5,71.1 JP3-FPGA1.6
DB9
  Top 0.15: U15.6 48.75,63.6 48.9,63.45 51.6,63.45 54.9,66.75 54.9,71.55 55.95,72.6 56.25,72.6 57,73.35 57,74.1 56.4,74.7 41.7,74.7 40.8,73.8 JP3-FPGA1.19
DB10
  Top 0.15: U15.5 49.2,64.5 49.2,65.25 48.6,65.85 47.85,65.85 47.4,66.3 47.4,70.2 46.8,70.8 46.8,71.55 45.75,72.6 44.4,72.6 43.35,73.65 JP3-FPGA1.17
DB11
  Top 0.15: U15.4 49.8,64.5 49.8,66 49.95,66.15 49.95,68.85 48.75,70.05 48,70.05 47.1,70.95 47.1,72.45 45.9,73.65 JP3-FPGA1.15
DB12
  Top 0.15: U15.3 50.25,70.35 49.35,71.25 49.35,72.75 48.45,73.65 JP3-FPGA1.13
DB13
  Top 0.15: U15.2 50.85,64.5 50.85,69.75 52.35,71.25 52.35,72.6 53.4,73.65 JP3-FPGA1.9
DB14
  Top 0.15: U15.1 51.3,64.5 51.3,67.65 54.6,70.95 54.6,72.45 55.8,73.65 JP3-FPGA1.7
DB15  (via drill 0.35)
  Top 0.15: v53.25,64.35 53.25,62.55 U15.64
  Bottom 0.15: v53.25,64.35 53.25,66.6 57.45,70.8 57.45,72.75 58.35,73.65 JP3-FPGA1.5
DGND  (via drill 0.35)
  Top 0.15: U5.3 5.25,52.8 5.25,54.6 4.8,55.05 U5.9 | 5.25,56.1 5.25,55.65 4.8,55.2 U5.9 | 5.25,56.1 5.25,57.3 U5.6 | 9.45,60.6 10.5,61.65 12.3,61.65 12.46,61.49 12.46,58.49 | 9.45,60.6 9,60.15 8.7,60.15 C9.2 | 5.25,56.1 7.05,56.1 7.95,57 10.95,57 12.45,58.5 12.46,58.49 | 5.25,56.1 U5.9 | 5.25,27.45 5.25,28.05 4.8,28.5 U6.EPAD | 5.25,27.45 5.25,26.25 U6.3 | U6.6 5.25,31.05 5.25,29.1 4.8,28.65 U6.EPAD | 12.3,26.7 7.65,26.7 6.9,27.45 5.25,27.45 | 5.25,27.45 U6.EPAD | 6.75,37.2 6.75,38.7 | 6.75,38.7 6.75,39.9 U16.4 6.6,40.05 6.6,40.5 4.8,42.3 U16.9 | 6.75,37.2 C13.2 6.75,37.2 | 6.75,37.2 6.45,36.9 C14.2 3.2,36.9 1.41,35.11 1.41,25.89 2.83,24.47 13.67,24.47 14.2,25 15.23,26.03 15.3,26.1 15.3,27 14.7,27.6 13.8,27.6 12.9,26.7 12.3,26.7 | 8.4,47.55 6.15,47.55 6,47.7 6,47.85 4.8,49.05 R15.2 | 8.4,47.55 9.9,49.05 C10.2 | 8.4,47.55 C45.2 | 6.75,38.7 10.2,38.7 11.7,40.2 C16.2 11.7,40.35 C45.2 | 12.3,26.7 TP1.1 | 12.46,58.49 16.28,54.67 16.28,48.83 C45.2 | 36.45,69.45 36.45,64.2 C77.1 | 36.45,69.45 38.1,71.1 JP3-FPGA1.22 | 36.45,69.45 27.15,69.45 25.5,71.1 JP3-FPGA1.32 | 47.7,62.4 45.3,60 41.85,60 U15.22 | 47.7,62.4 47.7,64.35 U15.8 | 47.7,62.4 48.9,61.2 | 48.9,61.2 50.25,59.85 53.1,59.85 U15.59 | v62.25,62.7 64.8,60.15 65.1,60.15 C67.2 65.1,60 v70.8,60 | v48.75,69.3 48.75,67.5 C76.1 | JP3-FPGA1.11 50.85,73.65 50.85,71.25 JP3-FPGA1.12 | v48.9,61.35 48.9,61.2 | 9.45,60.6 6.15,63.9 6.15,65.7 6.45,66 8.1,66 9.75,64.35 9.75,63.9 9.9,63.75 11.85,63.75 13.52,65.42 14.25,66.15 14.25,72.6 15.3,73.65 JP3-FPGA1.39
  Top 0.152: R1.1 15.9,23.29 14.2,25 | 15.23,26.03 17.74,26.03 18.97,24.8 18.97,18.56 11.42,11.01 R5.1 | R4.1 18.82,60.11 13.52,65.42
  Bottom 0.15: 38.25,72.6 38.25,71.25 JP3-FPGA1.22 | 38.25,72.6 38.25,73.65 JP3-FPGA1.21 | JP3-FPGA1.39 15.3,73.8 16.5,73.8 17.7,75 24.15,75 25.35,73.8 JP3-FPGA1.31 25.5,73.65 25.5,71.25 JP3-FPGA1.32 | v62.25,62.7 52.05,62.7 51.15,63.6 | 51.15,63.6 51,63.75 51,69.3 | 51,69.3 51,71.1 JP3-FPGA1.12 | 51,69.3 v48.75,69.3 | v70.8,60 71.54,60 86.24,45.3 94.65,45.3 95.25,45.9 95.25,46.95 93.45,48.75 JP2.14 | 51.15,63.6 v48.9,61.35 | 38.25,72.6 49.8,72.6 50.85,73.65 JP3-FPGA1.11
  other vias: 25.67,61.55 46.43,60.7 43.92,61.47 42.95,65.43 52.01,69.45 53.33,68.49 57.07,69.29 54.34,64.67
  pour Bottom: 0.01,79.98 0.02,79.99 69.61,79.99 69.61,58.84 69.6,58.83 23.54,58.83 23.53,58.82 23.53,0.02 0.03,0.02
  pour Top: 0.12,0.01 23.55,0.01 23.55,58.81 69.62,58.81 69.62,79.86 0.12,79.86
DV1.2  (via drill 0.35)
  Top 0.15: U16.1 2.85,40.05 4.05,40.05 U16.2 4.2,40.05 5.25,40.05 U16.3 5.4,39.9 6,39.3 v6,38.55 | v7.65,40.2 9,40.2 C16.1
  Top 0.152: LED5.A 11.36,5.63 TP2.1 11.04,7.21 11.04,8.7 | LED5.C 13.3,11.07 13.3,9.64 12.36,8.7 11.04,8.7 | 11.04,8.7 R5.2
  Bottom 0.15: 9.45,5.7 TP2.1
  Bottom 0.254: v7.65,40.2 v6,38.55 9.45,35.1 9.45,5.7
DV3.3  (via drill 0.35)
  Top 0.15: 63.6,71.25 JP3-FPGA1.2 | 63.6,73.65 JP3-FPGA1.1 | 4.2,26.1 4.2,25.59 | 2.85,26.1 U6.1 2.7,26.25 | 5.92,34.2 7.05,34.2 C13.1
  Top 0.152: LED4.A v13.17,23.29 13.21,23.25 R1.2 14.18,23.25 15.16,22.27 15.41,22.27 LED4.C | 4.05,26.1 4.06,26.1 U6.2 4.17,26.13 4.2,26.1
  Top 0.254: 63.6,73.65 63.6,71.25 | 4.2,25.59 4.94,24.85 12.55,24.85 TP3.1 | 4.05,26.1 2.85,26.1 | 5.92,34.2 4.87,35.25 2.06,35.25 1.8,34.99 1.8,27.15 2.7,26.25
  Bottom 0.15: 63.45,71.1 JP3-FPGA1.2 | 14.4,26.7 TP3.1
  Bottom 0.152: v13.17,23.29 13.17,25.47 TP3.1
  Bottom 0.254: 63.45,71.1 63.45,62.15 58,56.7 42.08,56.7 14.4,29.02 14.4,26.7
EOC  (via drill 0.35)
  Top 0.15: U15.18 42.6,61.95 42.75,62.1 42.75,62.85 v42.3,63.3
  Bottom 0.15: v42.3,63.3 42.3,65.55 37.8,70.05 29.1,70.05 28.05,71.1 JP3-FPGA1.30
N$2
  Top 0.15: U10.13 72.3,27.9 64.95,27.9 63.75,29.1 63.3,29.1 U10.3
N$3
  Top 0.15: 4.35,51.9 4.2,52.05 4.2,52.65 U5.2 4.35,51.9 | 4.35,51.9 4.95,51.3 10.91,51.3 13.01,49.2 14.85,49.2 R14.1 | 4.35,51.9 2.1,49.65 2.1,49.2 R15.1
N$4
  Top 0.15: U11.13 47.55,27 40.2,27 39.15,28.05 38.55,28.05 U11.3
N$5
  Top 0.15: U12.13 47.55,12.3 40.2,12.3 39.15,13.35 38.55,13.35 U12.3
N$6
  Top 0.15: U13.13 72.3,40.2 64.95,40.2 63.75,41.4 63.3,41.4 U13.3
N$7
  Top 0.15: U14.13 47.55,39.3 40.2,39.3 39.15,40.35 38.55,40.35 U14.3
N$8
  Top 0.15: R7.3 70.35,17.85 70.35,19.05 73.8,22.5 73.8,29.55 73.05,30.3 72.45,30.3 U10.15
N$9  (via drill 0.35)
  Top 0.15: v67.35,28.5 71.7,28.5 72.3,29.1 U10.14
  Bottom 0.15: v67.35,28.5 65.25,26.4 65.25,17.85 R7.1
N$10
  Top 0.15: R8.3 66.6,1.65 66.6,6.45 71.25,11.1 73.5,11.1 73.8,11.4 73.8,13.35 73.05,14.1 72.45,14.1 U8.15
N$11
  Top 0.15: 82.05,9.3 82.05,9.6 82.5,10.05 89.85,10.05 91.35,11.55 97.95,11.55 R19.3 | 82.05,9.3 83.1,8.25 84.3,8.25 U9.2 | 82.05,9.3 79.65,11.7 78.75,11.7 R17.2
N$12
  Top 0.15: R8.1 61.5,1.65 61.5,6.45 61.8,6.75 61.8,13.35 61.95,13.5 71.85,13.5 72.3,13.05 U8.14
N$14  (via drill 0.35)
  Top 0.15: v41.55,34.95 46.95,29.55 47.55,29.55 U11.15
  Bottom 0.15: v41.55,34.95 27.6,34.95 26.85,34.2 26.85,33.6 27.15,33.3 27.15,24.3 26.4,23.55 26.4,19.5 R9.3
N$15
  Top 0.15: R9.1 26.4,24.6 28.95,24.6 32.55,28.2 36.75,28.2 37.35,28.8 46.95,28.8 47.55,28.2 U11.14
N$16
  Top 0.15: R10.3 50.4,35.1 50.4,37.65 53.1,40.35 53.1,40.65 52.05,41.7 47.7,41.7 U14.15
N$17
  Top 0.15: R10.1 48,40.05 47.7,40.35 U14.14
N$18
  Top 0.15: R11.3 81.3,42.75 72.45,42.75 U13.15
N$19
  Top 0.15: U8.13 72.3,11.7 64.95,11.7 63.75,12.9 63.3,12.9 U8.3
N$20
  Top 0.15: R11.1 86.25,42.6 82.2,42.6 81.15,41.55 72.45,41.55 U13.14
N$21
  Top 0.15: R12.3 40.35,4.5 39.3,4.5 36.06,7.74 36.06,11.16 37.05,12.15 37.05,13.8 37.35,14.1 46.95,14.1 47.55,14.7 U12.15
N$22
  Top 0.15: R12.1 45.6,4.5 46.8,4.5 49.05,6.75 49.05,12.6 48.3,13.35 47.7,13.35 U12.14
N$23
  Top 0.15: C34.2 28.5,30.15 28.95,30.15 30.6,31.8 32.55,31.8 34.2,30.15 C33.2
N$25
  Top 0.15: R14.3 14.85,54.15 12.45,51.75 R14.2 12.3,51.75 11.1,52.95 9.3,52.95 R16.2
N$28
  Top 0.15: R18.2 78.75,14.4 R17.1
OUT_AMP_1  (via drill 0.35)
  Top 0.15: v44.25,51.3 U15.34 | v70.65,7.95 72.3,7.95 U8.10 | U8.9 72.3,6.75 72.3,7.8 U8.10 | C23.1 75.45,9.6 74.55,9.6 72.9,7.95 72.45,7.95 U8.10
  Bottom 0.15: v44.25,51.3 44.25,50.1 51.9,42.45 51.9,26.7 v70.65,7.95
OUT_AMP_2  (via drill 0.35)
  Top 0.15: U10.10 72.3,24 72.3,22.95 U10.9 72.3,22.8 72.3,21.45 69.45,18.6 69.45,17.55 69.9,17.1 70.65,17.1 75,21.45 75,28.05 C24.1 75,28.2 74.1,29.1 v74.1,30 | v45.75,51.3 U15.37
  Bottom 0.15: v45.75,51.3 45.75,49.5 55.2,40.05 64.05,40.05 v74.1,30
OUT_AMP_3
  Top 0.15: U11.10 47.7,22.95 47.7,21.9 U11.9 47.7,21.75 47.7,19.35 | 47.7,19.35 47.85,19.35 C25.1 47.7,19.35 | 47.7,19.35 30,19.35 24.6,24.75 24.6,41.4 34.5,51.3 40.5,51.3 44.1,54.9 45.6,54.9 46.65,53.85 46.65,53.1 U15.39
OUT_AMP_4  (via drill 0.35)
  Top 0.15: v48.15,51.45 48.15,52.95 U15.42 | v70.65,36.45 72.3,36.45 U13.10 | U13.9 72.3,35.25 72.3,36.3 U13.10 | C27.1 75,36.45 72.45,36.45 U13.10
  Bottom 0.15: v48.15,51.45 48.15,47.55 55.35,40.35 66.75,40.35 v70.65,36.45
OUT_AMP_5
  Top 0.15: U12.10 47.7,8.25 47.7,7.2 U12.9 47.55,7.05 47.1,7.05 44.7,4.65 44.7,4.2 45.3,3.6 46.35,3.6 50.7,7.95 C26.1 50.85,10.65 52.35,12.15 52.35,14.3 50,16.65 32.25,16.65 24.3,24.6 24.3,41.55 34.35,51.6 40.35,51.6 46.8,58.05 48.3,58.05 52.5,53.85 52.5,51.9 52.05,51.45 50.1,51.45 49.35,52.2 49.35,52.95 U15.44
OUT_AMP_6  (via drill 0.35)
  Top 0.15: v51.9,52.05 51.75,51.9 51.15,51.9 50.85,52.2 50.85,52.95 U15.47 | v52.5,40.5 52.5,40.2 49.05,36.75 49.05,36.15 48.3,35.4 47.7,35.4 U14.10 47.7,35.25 47.7,34.35 | 47.7,34.35 47.7,34.2 U14.9 47.7,34.35 | v26.85,7.35 26.85,5.85 C28.1 | 47.7,34.35 v46.05,34.35
  Bottom 0.15: v51.9,52.05 45.75,52.05 45.15,51.45 45.15,49.65 52.5,42.3 v52.5,40.5 | v26.85,7.35 26.85,18.9 27.45,19.5 27.45,33.45 27.15,33.75 27.15,34.05 27.75,34.65 41.1,34.65 41.4,34.35 v46.05,34.35
PG  (3 unrouted)
  Top 0.15: 4.2,31.2 U6.7 | 83.1,66.45 U4.7 | 82.95,51.6 U1.7 | 83.4,59.1 83.1,59.1 U2.7
RD
  Top 0.15: U15.63 54,61.95 55.2,63.15 55.2,69 57.3,71.1 57.3,74.25 56.55,75 34.35,75 33.15,73.8 JP3-FPGA1.25
RDC  (via drill 0.35)
  Top 0.15: 36,49.35 37.65,51 40.65,51 42.6,52.95 43.65,52.95 U15.33 | 55.35,51 55.35,50.1 52.2,46.95 C69.1 | U15.40 47.25,54.45 48.15,55.35 | 48.15,55.35 49.65,55.35 51.15,53.85 51.15,53.1 U15.48 51.3,52.95 51.45,52.8 v51.9,52.8 | U15.54 53.25,57.45 53.25,57.9 U15.55 53.1,57.9 v51.15,57.9 | 41.85,57.9 41.85,57.45 U15.27 | v43.05,57.9 41.85,57.9 | v40.5,60.45 39.45,60.45 39.3,60.6 | 41.85,57.9 U15.26 | 39.3,60.6 39.3,57.3 C78.1 | 39.3,60.6 C71.1 | v48.15,57.45 48.15,55.35 | v53.7,51 55.35,51 | 55.35,51 C70.1 | v34.65,50.7 36,49.35 | 36,49.35 C68.1
  Bottom 0.15: v40.5,60.45 42.6,58.35 | 42.6,58.35 v43.05,57.9 48.15,57.9 | 48.15,57.9 v51.15,57.9 | 48.15,57.9 v48.15,57.45 | v51.9,52.8 v53.7,51 | v34.65,50.7 34.95,50.7 42.6,58.35
REFIO  (via drill 0.35)
  Top 0.15: v47.85,54.22 47.85,53.1 U15.41 | v43.5,51.6 41.4,49.5 C72.1
  Bottom 0.15: v47.85,54.22 46.12,54.22 v43.5,51.6
S1+  (via drill 0.35)
  Top 0.15: C30.1 57.6,12.75 59.25,14.4 61.2,14.4 61.35,14.25 63.15,14.25 U8.2 63.3,14.25 64.35,14.25 v65.55,15.45 | v83.4,21.9 90.16,21.9 92.11,19.95 94.05,19.95 95.55,18.45 96.9,18.45 JP1.2
  Bottom 0.15: v83.4,21.9 72,21.9 v65.55,15.45
S1-  (via drill 0.35)
  Top 0.15: C29.1 57.75,16.05 59.4,17.7 61.35,17.7 63.15,15.9 63.15,15.6 U8.1 63.3,15.45 v64.8,15.45 | v85.35,14.55 v92.25,14.55
  Bottom 0.15: v92.25,14.55 97.95,14.55 98.85,15.45 98.85,18.75 97.05,20.55 97.05,20.85 JP1.3 | v85.35,14.55 65.7,14.55 v64.8,15.45
S2+  (via drill 0.35)
  Top 0.15: v61.05,30.3 61.5,30.3 | 61.5,30.3 63.15,30.3 U10.2 | v58.35,27.6 57.3,27.6 57.15,27.45 C31.1 | 83.8,23.6 85.05,22.35 94.5,22.35 95.25,23.1 95.25,26.55 96.9,28.2 96.9,28.5 JP1.6 | 78.75,22.95 72.6,16.8 69.75,16.8 68.4,18.15 68.4,20.7 64.35,24.75 61.95,24.75 61.5,25.2 61.5,30.3
  Top 0.152: 78.75,22.95 79.4,23.6 83.8,23.6
  Bottom 0.15: v58.35,27.6 v61.05,30.3
S2-
  Top 0.15: C32.1 57,30.75 58.5,32.25 60.75,32.25 61.2,31.8 63.15,31.8 U10.1 63.3,31.8 63.75,32.25 77.7,32.25 80.7,35.25 87,35.25 92.25,30 94.5,30 95.55,31.05 96.9,31.05 JP1.7
S3+  (via drill 0.35)
  Top 0.15: C33.1 31.5,30 33,28.5 35.25,28.5 36.15,29.4 38.4,29.4 U11.2 38.55,29.55 v45,29.55 | v85.2,39.9 94.5,39.9 95.55,38.85 96.9,38.85 JP1.10 | v55.05,41.85 55.05,40.65 51.15,36.75 51.15,34.72 50.33,33.9 v49.35,33.9
  Bottom 0.15: v85.2,39.9 83.4,41.7 55.2,41.7 v55.05,41.85 | v45,29.55 v49.35,33.9
S3-  (via drill 0.35)
  Top 0.15: v35.55,30.75 38.4,30.75 U11.1 | v28.5,34.05 28.5,33.75 25.8,31.05 25.8,30.15 C34.1 | v61.35,39.45 73.35,39.45 74.85,40.95 84.9,40.95 85.65,40.2 94.5,40.2 95.55,41.25 96.9,41.25 JP1.11 | v54.6,32.86 49.81,32.86 v49.65,32.7
  Bottom 0.15: v28.5,34.05 29.55,34.05 32.85,30.75 v35.55,30.75 37.35,28.95 45.15,28.95 48.9,32.7 v49.65,32.7 | v61.35,39.45 61.19,39.45 v54.6,32.86
S4+
  Top 0.15: C44.1 60.15,41.25 61.5,42.6 63.15,42.6 U13.2 63.3,42.75 63.75,42.75 68.55,47.55 94.35,47.55 95.55,48.75 96.9,48.75 JP1.14
S4-
  Top 0.15: C37.1 60.15,44.25 60.3,44.1 63.15,44.1 U13.1 63.3,44.1 67.05,47.85 87.6,47.85 89.7,49.95 94.2,49.95 95.55,51.3 96.9,51.3 JP1.15
S5+  (via drill 0.35)
  Top 0.15: C36.1 35.85,13.5 37.05,14.7 38.4,14.7 U12.2 38.55,14.7 v40.2,14.7
  Bottom 0.15: v40.2,14.7 54.45,14.7 67.95,1.2 89.1,1.2 99.51,11.61 99.51,56.19 97.05,58.65 97.05,58.95 JP1.18
S5-
  Top 0.15: 32.7,15.6 30.6,13.5 C35.1 | 32.7,15.6 33,15.9 38.4,15.9 U12.1 | 32.7,15.6 21.6,26.7 21.6,73.8 26.33,78.53 97.12,78.53 98.85,76.8 98.85,63.75 97.05,61.95 97.05,61.65 JP1.19
S6+  (via drill 0.35)
  Top 0.15: C59.1 35.7,39.9 37.5,41.7 38.4,41.7 U14.2 38.55,41.85 40.8,41.85 41.4,42.45 v55.65,42.45 | v89.4,13.95 93.75,13.95 95.25,15.45 95.25,16.2 93.45,18 93.45,18.3 JP2.2
  Bottom 0.15: v89.4,13.95 89.4,22.35 89.85,22.8 89.85,36 83.85,42 56.1,42 v55.65,42.45
S6-  (via drill 0.35)
  Top 0.15: C60.1 35.55,43.05 38.4,43.05 U14.1 38.55,42.9 v41.1,42.9 | v87.3,5.55 85.95,5.55 85.5,5.1 72,5.1 v69,8.1
  Bottom 0.15: v87.3,5.55 93,5.55 96.3,8.85 96.3,9.3 91.65,13.95 91.65,18.9 93.3,20.55 93.3,20.85 JP2.3 | v69,8.1 69,9.15 50.25,27.9 50.25,33.75 v41.1,42.9
SHDN
  Top 0.15: U15.20 41.7,61.05 40.95,61.05 40.35,61.65 40.35,61.95 39.9,62.4 30.15,62.4 21.9,70.65 21.9,72.75 22.8,73.65 JP3-FPGA1.33
TEST0  (via drill 0.35)
  Top 0.15: 40.65,55.35 34.8,55.35 33.75,54.3 C79.1 | 40.65,55.35 41.7,55.35 U15.31 | v80.25,35.55 87.15,35.55 91.5,31.2 93.3,31.2 JP2.7 | v48.6,44.25 v52.2,44.25 | 40.65,55.35 v40.65,54.45
  Bottom 0.15: v80.25,35.55 72.3,35.55 66.6,41.25 54.9,41.25 52.2,43.95 v52.2,44.25 | v48.6,44.25 40.65,52.2 v40.65,54.45
TEST1  (via drill 0.35)
  Top 0.15: v51.9,55.5 53.1,55.5 U15.50 | v61.2,55.5 62.4,55.5 63,56.1 C80.1 | v90.45,31.05 92.85,28.65 93.3,28.65 JP2.6
  Bottom 0.15: v51.9,55.5 v61.2,55.5 70.8,55.5 90.45,35.85 v90.45,31.05
WR
  Top 0.15: 59.55,70.8 55.5,66.75 55.5,62.55 54,61.05 53.25,61.05 U15.61 | 59.55,74.1 58.35,75.3 29.55,75.3 28.05,73.8 JP3-FPGA1.29
  Top 0.152: 59.55,74.1 59.55,70.8